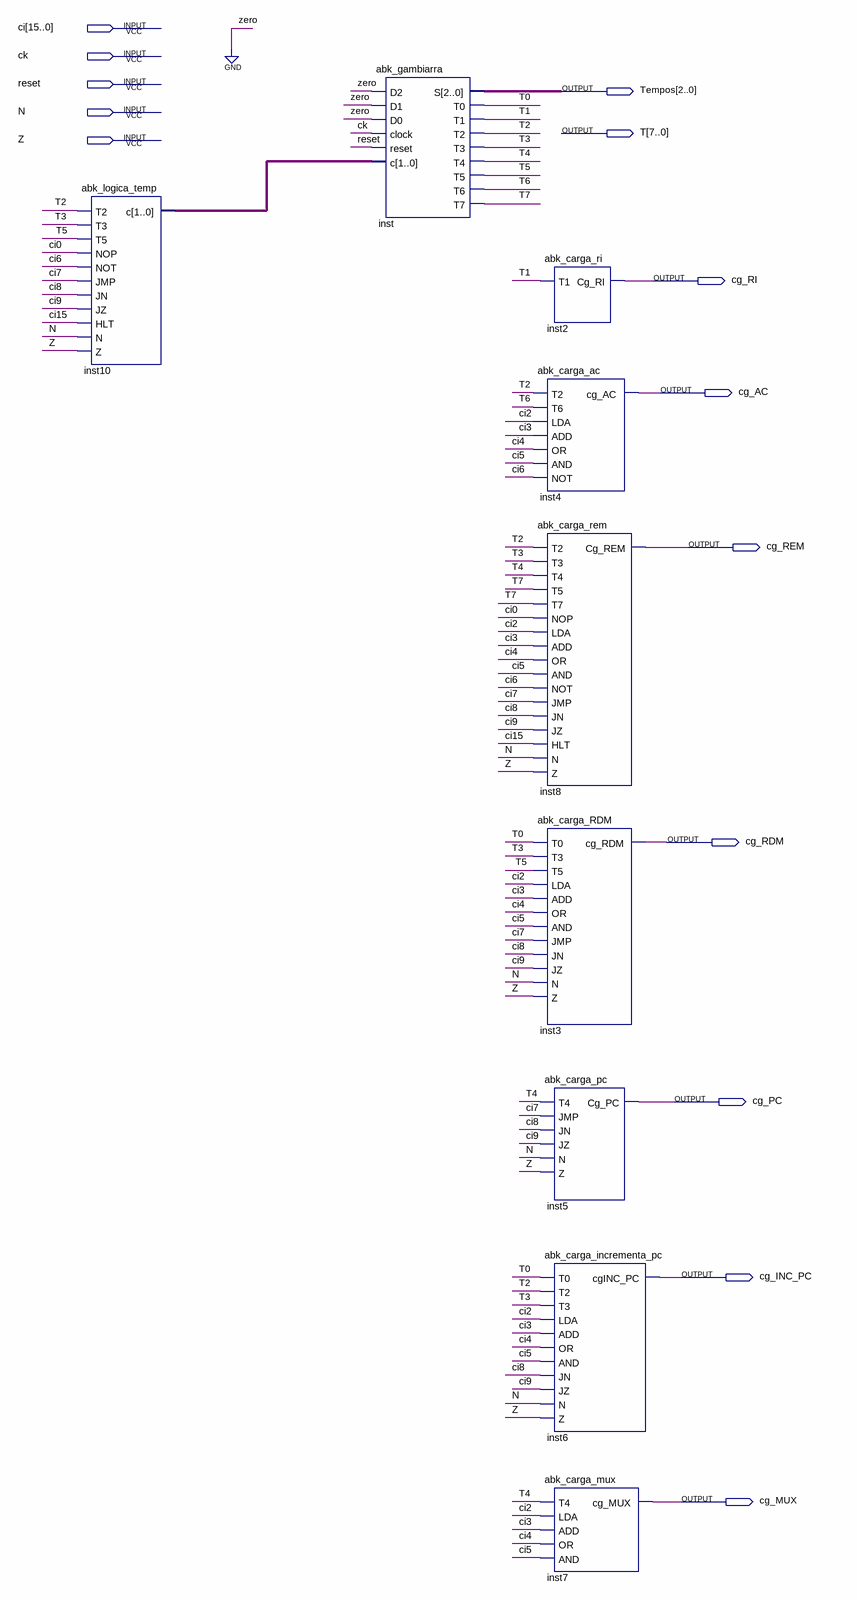
[diagram p0: schematic sheet]
// Quartus schematic abk_novo_cerebro.bdf as structural Verilog: 9 symbols, 14 pins
module abk_novo_cerebro (
  input  [15:0] ci,
  input  ck,
  input  reset,
  input  N,
  input  Z,
  output [2:0] Tempos,
  output [7:0] T,
  output cg_RI,
  output cg_AC,
  output cg_REM,
  output cg_RDM,
  output cg_PC,
  output cg_INC_PC,
  output cg_MUX
);

  wire [1:0] inst10_c;

  abk_logica_temp inst10 (
    .T2(T[2]), .T3(T[3]), .T5(T[5]), .NOP(ci[0]), .NOT(ci[6]), .JMP(ci[7]), .JN(ci[8]), .JZ(ci[9]),
    .HLT(ci[15]), .N(N), .Z(Z), .c(inst10_c));
  abk_gambiarra inst (
    .D2(1'b0), .D1(1'b0), .D0(1'b0), .clock(ck), .reset(reset), .c(inst10_c), .S(Tempos), .T0(T[0]),
    .T1(T[1]), .T2(T[2]), .T3(T[3]), .T4(T[4]), .T5(T[5]), .T6(T[6]), .T7(T[7]));
  abk_carga_ri inst2 (.T1(T[1]), .Cg_RI(cg_RI));
  abk_carga_ac inst4 (
    .T2(T[2]), .T6(T[6]), .LDA(ci[2]), .ADD(ci[3]), .OR(ci[4]), .AND(ci[5]), .NOT(ci[6]), .cg_AC(cg_AC));
  abk_carga_rem inst8 (
    .T2(T[2]), .T3(T[3]), .T4(T[4]), .T5(T[7]), .T7(T[7]), .NOP(ci[0]), .LDA(ci[2]), .ADD(ci[3]), .OR(ci[4]),
    .AND(ci[5]), .NOT(ci[6]), .JMP(ci[7]), .JN(ci[8]), .JZ(ci[9]), .HLT(ci[15]), .N(N), .Z(Z), .Cg_REM(cg_REM));
  abk_carga_RDM inst3 (
    .T0(T[0]), .T3(T[3]), .T5(T[5]), .LDA(ci[2]), .ADD(ci[3]), .OR(ci[4]), .AND(ci[5]), .JMP(ci[7]),
    .JN(ci[8]), .JZ(ci[9]), .N(N), .Z(Z), .cg_RDM(cg_RDM));
  abk_carga_pc inst5 (.T4(T[4]), .JMP(ci[7]), .JN(ci[8]), .JZ(ci[9]), .N(N), .Z(Z), .Cg_PC(cg_PC));
  abk_carga_incrementa_pc inst6 (
    .T0(T[0]), .T2(T[2]), .T3(T[3]), .LDA(ci[2]), .ADD(ci[3]), .OR(ci[4]), .AND(ci[5]), .JN(ci[8]),
    .JZ(ci[9]), .N(N), .Z(Z), .cgINC_PC(cg_INC_PC));
  abk_carga_mux inst7 (.T4(T[4]), .LDA(ci[2]), .ADD(ci[3]), .OR(ci[4]), .AND(ci[5]), .cg_MUX(cg_MUX));
endmodule
